# Altium schematic sheet Power.SchDoc
size A4
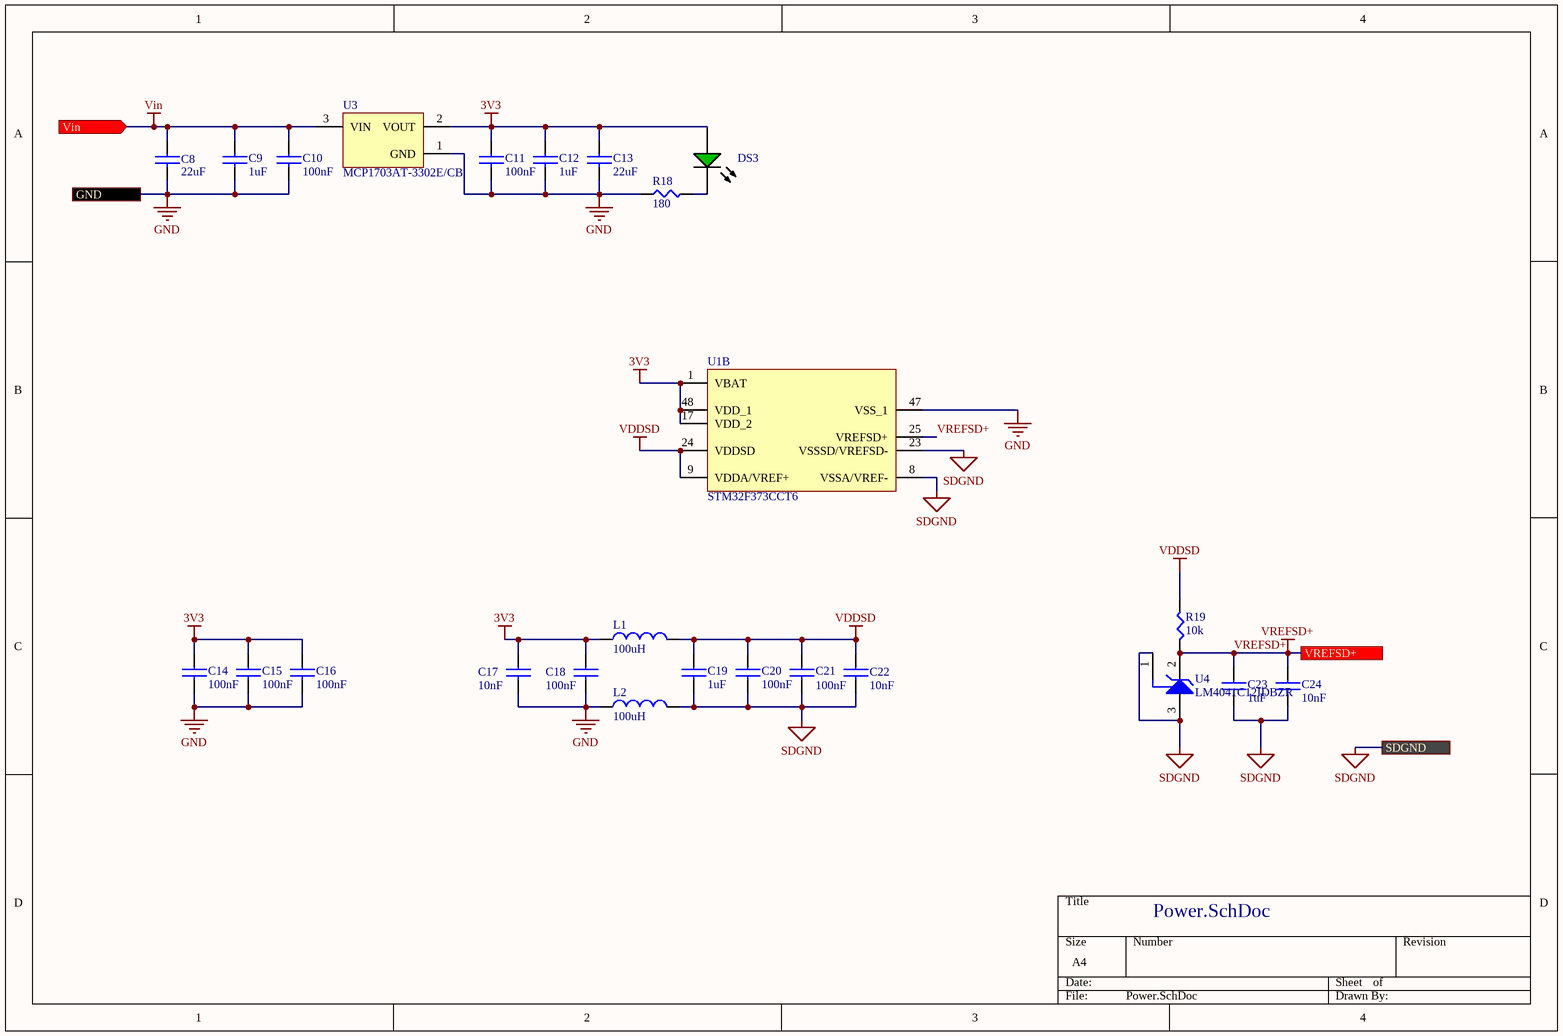
[diagram p0: Power.SchDoc]

## Parts
C8  22uF  [CAPC200X125X110L50N]
C9  1uF  [CAPC160X80X90L35N]
C10  100nF  [CAPC160X80X90L35N]
C11  100nF  [CAPC160X80X90L35N]
C12  1uF  [CAPC160X80X90L35N]
C13  22uF  [CAPC200X125X110L50N]
C14  100nF  [CAPC160X80X90L35N]
C15  100nF  [CAPC160X80X90L35N]
C16  100nF  [CAPC160X80X90L35N]
C17  10nF  [CAPC160X80X90L35N]
C18  100nF  [CAPC160X80X90L35N]
C19  1uF  [CAPC160X80X90L35N]
C20  100nF  [CAPC160X80X90L35N]
C21  100nF  [CAPC160X80X90L35N]
C22  10nF  [CAPC160X80X90L35N]
C23  1uF  [CAPC160X80X90L35N]
C24  10nF  [CAPC160X80X90L35N]
DS3  19-217/GHC-YR1S2/3T  [LEDC160X80X60L30N]  (value not drawn)
L1  100uH  [INDM320X250X240L55X190N]
L2  100uH  [INDM320X250X240L55X190N]
R18  180  [RESC160X80X90L30N]
R19  10k  [RESC160X80X90L30N]
U1  STM32F373CCT6  [STM-LQFP48_L]  (part B of 2)
U3  MCP1703AT-3302E/CB  [SOT-23A-CB3_M]
U4  LM4041C12IDBZR  [SOT-23A-CB3_M]

## Ports
GND, SDGND, Vin (in), VREFSD+

## Nets
3V3: C11.1 C12.1 C13.1 C14.1 C15.1 C16.1 C17.1 C18.1 DS3.A L1.1 U1.1(VBAT) U1.17(VDD_2) U1.48(VDD_1) U3.2(VOUT)
GND: C8.2 C9.2 C10.2 C11.2 C12.2 C13.2 C14.2 C15.2 C16.2 C17.2 C18.2 L2.1 R18.1 U1.47(VSS_1) U3.1(GND) ; port GND
SDGND: C19.2 C20.2 C21.2 C22.2 C23.2 C24.2 L2.2 U1.8(VSSA/VREF-) U1.23(VSSSD/VREFSD-) U4.1(CATHODE) U4.3(NC) ; port SDGND
VDDSD: C19.1 C20.1 C21.1 C22.1 L1.2 R19.2 U1.9(VDDA/VREF+) U1.24(VDDSD)
Vin: C8.1 C9.1 C10.1 U3.3(VIN) ; port Vin
VREFSD+: C23.1 C24.1 R19.1 U1.25(VREFSD+) U4.2(ANODE) ; port VREFSD+
NetDS3_C: DS3.C R18.2

## Library data of the parts
C8 C13 = capacitor: Part Number: CL21A226MAQNNNE; Value: 22uF; LCSC Part #: C45783
C9 C12 C19 C23 = capacitor: Part Number: CL10A105KB8NNNC; Value: 1uF; LCSC Part #: C15849
C10 C11 C14-C16 C18 C20 C21 = capacitor: Part Number: CC0603KRX7R9BB104; Value: 100nF; LCSC Part #: C14663
C17 C22 C24 = capacitor: Part Number: 0603B103K500NT; Value: 10nF; LCSC Part #: C57112
DS3 = LED: Green LED; Part Number: 19-217/GHC-YR1S2/3T; LCSC Part #: C72043
L1 L2 = Inductor: Part Number: NLV32T-101J-PF; Value: 100uH; Resistance: *; Package: *; LCSC Part #: C76836
R18 = Resistor: Part Number: 0603WAF1800T5E; Value: 180; LCSC Part #: C22828
R19 = Resistor: Part Number: 0603WAF1002T5E; Value: 10k; LCSC Part #: C25804
U1 = STM32F373CCT6: ARM Cortex-M4 32-bit MCU, 256 KB Flash, 32 KB Internal RAM, 36 I/Os, 48-pin LQFP, -40 to 85 degC, Tray; Manufacturer: STMicroelectronics; FLASH Size (Prog) (kB): 256; Internal RAM Size (kB): 32; Operating Frequency(F) (Processor speed) (MHz): 72; I/Os (High Current): 36; Supply Voltage(Vcc) min (V): 2; Mounting Technology: Surface Mount; ComponentLink2Description: Datasheet; PackageReference: LQFP48; Packing: Tray; PackageVersion: Rev. 6, 06/2013; ComponentLink1Description: Manufacturer URL; ComponentLink3Description: Package Specification; ComponentLink2URL: http://www.st.com/st-web-ui/static/active/en/resource/technical/document/datasheet/DM00046749.pdf; PartNumber: STM32F373CCT6; Core: ARM Cortex-M4; ComponentLink1URL: http://www.st.com/web/en/home.html; ComponentLink3URL: http://www.st.com/st-web-ui/static/active/en/resource/technical/document/datasheet/DM00058181.pdf; DatasheetVersion: Rev. 3; PackageDescription: 48-Pin Low Profile Quad Flat Package, 7 x 7 mm Body, 0.5 mm Pitch; LCSC Part #: C89403; Manufacturer Part Number: STM32F373CCT6
U3 = CMP-0136-00758-1: PackageReference: SOT-23A-CB3; PackageVersion: revBB, Aug-2009; DatasheetVersion: revD, Sep-2009; PackageDescription: 3-Lead Plastic Small Outline Transistor (CB) [SOT-23A]; Part Number: MCP1703; LCSC Part #: C144183
U4 = LMZ4041C12IDBZR: Precision Micropower Shunt Voltage Reference, 0.5% accuracy, 1.2 V, 15 ppm / degC, 12 mA, -40 to 85 degC, 3-pin SOT-23 (DBZ), Green (RoHS & no Sb/Br); Manufacturer: Texas Instruments; Rating: Catalog; Temp Coeff(Max)(ppm/ degree C): 100; Min Iz for Regulation(uA): 60; Iout/Iz(Max)(mA): 12; Temp Coeff(Typ)(ppm/ degree C): 15; Initial Accuracy @ 25/deg C(%): 0.5; VO(V): 1.225; ComponentLink3URL: http://www.ti.com/litv/pdf/mpds108a; Code_JEDEC: TO-236; PackageVersion: 4203227/B; SubFamily: Shunt Voltage Reference; ComponentLink4Description: URL Link1; ComponentLink4URL: Samples URL:http://www.ti.com/product/lm4041c12; Mounting Technology: Surface Mount; ComponentLink1URL: http://www.ti.com/; ComponentLink2URL: http://www.ti.com/general/docs/lit/getliterature.tsp?genericPartNumber=LM4041C12&fileType=pdf; Eco-Plan: Green (RoHS & no Sb/Br); PackageReference: DBZ0003A; PackageDescription: 3-Pin Plastic Small Outline, Body 2.92 x 1.3 mm, Pitch 0.95 mm; PartNumber: LM4041C12IDBZR; DatasheetVersion: SLCS146E; ComponentLink2Description: Datasheet; ComponentLink1Description: Manufacturer URL; ComponentLink3Description: Package Specification; LCSC Part #: C133587